# Altium schematic sheet RGB Matrix.SchDoc
size Letter
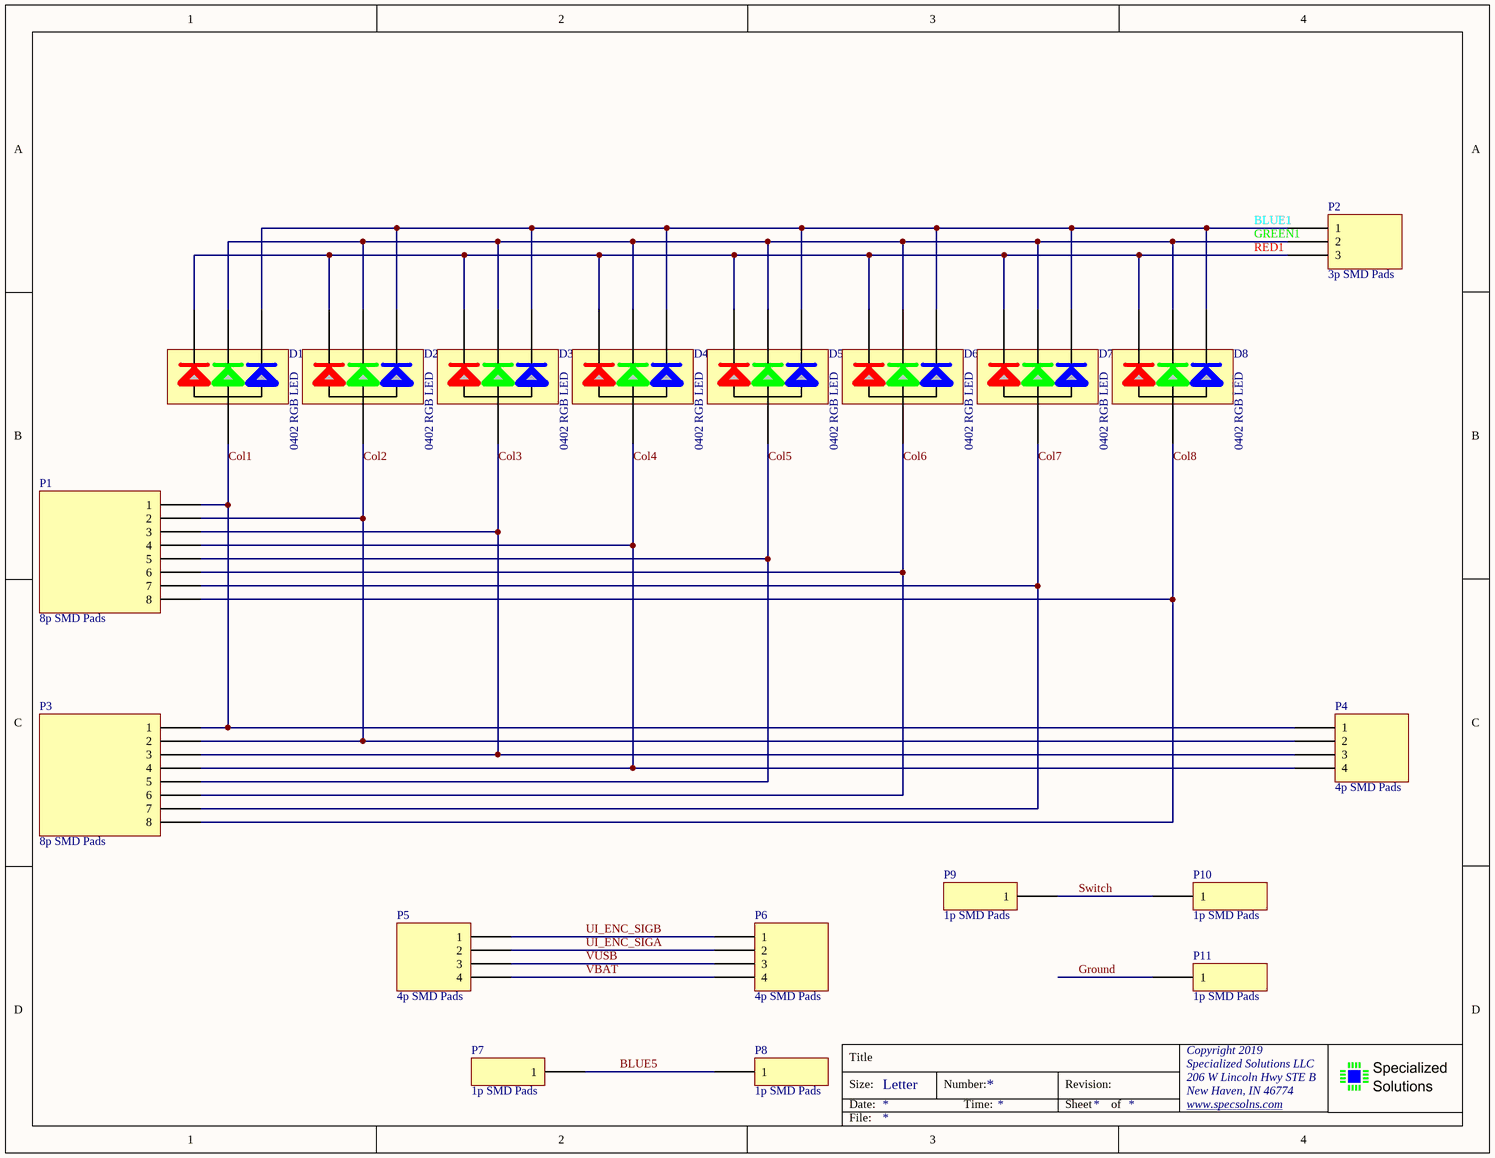
[diagram p0: RGB Matrix.SchDoc]

## Parts
D1  0402 RGB LED  [0404 RGB LED]
D2  0402 RGB LED  [0404 RGB LED]
D3  0402 RGB LED  [0404 RGB LED]
D4  0402 RGB LED  [0404 RGB LED]
D5  0402 RGB LED  [0404 RGB LED]
D6  0402 RGB LED  [0404 RGB LED]
D7  0402 RGB LED  [0404 RGB LED]
D8  0402 RGB LED  [0404 RGB LED]
P1  8p SMD Pads  [8p SMD pad]
P2  3p SMD Pads  [3p SMD pad]
P3  8p SMD Pads  [8p SMD pad]
P4  4p SMD Pads  [4p SMD pad]
P5  4p SMD Pads  [4p SMD pad]
P6  4p SMD Pads  [4p SMD pad]
P7  1p SMD Pads  [1p SMD pad]
P8  1p SMD Pads  [1p SMD pad]
P9  1p SMD Pads  [1p SMD pad]
P10  1p SMD Pads  [1p SMD pad]
P11  1p SMD Pads  [1p SMD pad]

## Nets
BLUE1: D1.4 D2.4 D3.4 D4.4 D5.4 D6.4 D7.4 D8.4 P2.1
BLUE5: P7.1 P8.1
Col1: D1.1 P1.1 P3.1 P4.1
Col2: D2.1 P1.2 P3.2 P4.2
Col3: D3.1 P1.3 P3.3 P4.3
Col4: D4.1 P1.4 P3.4 P4.4
Col5: D5.1 P1.5 P3.5
Col6: D6.1 P1.6 P3.6
Col7: D7.1 P1.7 P3.7
Col8: D8.1 P1.8 P3.8
GREEN1: D1.3 D2.3 D3.3 D4.3 D5.3 D6.3 D7.3 D8.3 P2.2
Ground: P11.1
RED1: D1.2 D2.2 D3.2 D4.2 D5.2 D6.2 D7.2 D8.2 P2.3
Switch: P9.1 P10.1
UI_ENC_SIGA: P5.2 P6.2
UI_ENC_SIGB: P5.1 P6.1
VBAT: P5.4 P6.4
VUSB: P5.3 P6.3

## Notes on the sheet
- Title
- Size:
- Date:
- Letter
- Number:
- Time:
- Revision:
- Sheet
- of
- Copyright 2019
- Specialized Solutions LLC
- 206 W Lincoln Hwy STE B
- New Haven, IN 46774
- www.specsolns.com <http://www.specsolns.com>
- File:

## Library data of the parts
P2 = 3p SMD
P4-P6 = 4p SMD
P7-P11 = 1p SMD